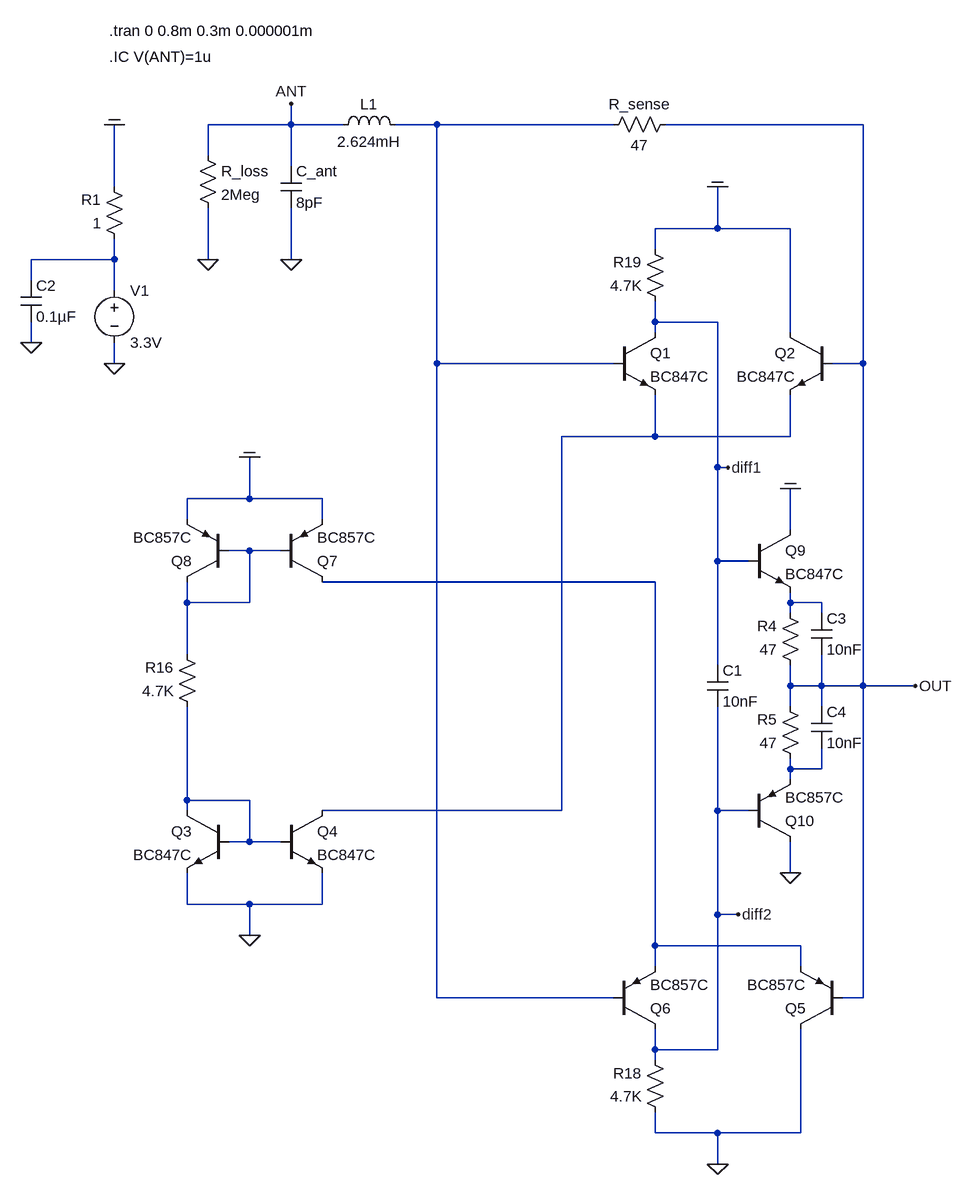
[diagram p0: schematic 2020_current_sense_comparator_npn_pnp_v02.asc]
2020_current_sense_comparator_npn_pnp_v02.asc, the LTspice schematic file:
Version 4
SHEET 1 3920 3748
WIRE -528 480 -528 448
WIRE -528 480 -656 480
WIRE -448 480 -528 480
WIRE -304 480 -368 480
WIRE -32 480 -304 480
WIRE 352 480 48 480
WIRE -656 528 -656 480
WIRE -528 544 -528 480
WIRE -800 576 -800 480
WIRE 128 640 128 576
WIRE 128 640 32 640
WIRE 240 640 128 640
WIRE 32 672 32 640
WIRE -800 688 -800 656
WIRE -800 688 -928 688
WIRE -656 688 -656 608
WIRE -528 688 -528 608
WIRE -928 720 -928 688
WIRE -800 736 -800 688
WIRE 32 784 32 752
WIRE 128 784 32 784
WIRE 32 800 32 784
WIRE 240 800 240 640
WIRE -928 816 -928 784
WIRE -800 848 -800 816
WIRE -304 848 -304 480
WIRE -32 848 -304 848
WIRE 352 848 352 480
WIRE 352 848 304 848
WIRE 32 960 32 896
WIRE 32 960 -112 960
WIRE 240 960 240 896
WIRE 240 960 32 960
WIRE 128 1008 128 784
WIRE 144 1008 128 1008
WIRE -592 1056 -592 992
WIRE -592 1056 -688 1056
WIRE -480 1056 -592 1056
WIRE -688 1088 -688 1056
WIRE -480 1088 -480 1056
WIRE 240 1104 240 1040
WIRE -592 1136 -624 1136
WIRE -544 1136 -592 1136
WIRE 128 1152 128 1008
WIRE 176 1152 128 1152
WIRE 32 1184 -480 1184
WIRE -688 1216 -688 1184
WIRE -592 1216 -592 1136
WIRE -592 1216 -688 1216
WIRE 240 1216 240 1200
WIRE 288 1216 240 1216
WIRE 240 1232 240 1216
WIRE 288 1232 288 1216
WIRE -688 1296 -688 1216
WIRE 128 1312 128 1152
WIRE 240 1344 240 1312
WIRE 288 1344 288 1296
WIRE 288 1344 240 1344
WIRE 352 1344 352 848
WIRE 352 1344 288 1344
WIRE 432 1344 352 1344
WIRE 240 1376 240 1344
WIRE 288 1376 288 1344
WIRE 240 1472 240 1456
WIRE 288 1472 288 1440
WIRE 288 1472 240 1472
WIRE 240 1488 240 1472
WIRE -688 1520 -688 1376
WIRE -592 1520 -688 1520
WIRE -688 1536 -688 1520
WIRE -112 1536 -112 960
WIRE -112 1536 -480 1536
WIRE 128 1536 128 1376
WIRE 176 1536 128 1536
WIRE -592 1584 -592 1520
WIRE -592 1584 -624 1584
WIRE -544 1584 -592 1584
WIRE 240 1632 240 1584
WIRE -688 1680 -688 1632
WIRE -592 1680 -688 1680
WIRE -480 1680 -480 1632
WIRE -480 1680 -592 1680
WIRE 128 1696 128 1536
WIRE 160 1696 128 1696
WIRE -592 1728 -592 1680
WIRE 32 1744 32 1184
WIRE 256 1744 32 1744
WIRE 32 1776 32 1744
WIRE 256 1776 256 1744
WIRE -304 1824 -304 848
WIRE -32 1824 -304 1824
WIRE 352 1824 352 1344
WIRE 352 1824 320 1824
WIRE 32 1904 32 1872
WIRE 128 1904 128 1696
WIRE 128 1904 32 1904
WIRE 32 1920 32 1904
WIRE 32 2032 32 2000
WIRE 128 2032 32 2032
WIRE 256 2032 256 1872
WIRE 256 2032 128 2032
WIRE 128 2080 128 2032
FLAG -800 848 0
FLAG -800 480 COM
FLAG -528 688 0
FLAG -528 448 ANT
FLAG -656 688 0
FLAG -592 1728 0
FLAG 128 576 COM
FLAG -592 992 COM
FLAG 128 2080 0
FLAG 240 1040 COM
FLAG 240 1632 0
FLAG 432 1344 OUT
FLAG 144 1008 diff1
FLAG 160 1696 diff2
FLAG -928 816 0
SYMBOL voltage -800 720 R0
WINDOW 123 0 0 Left 0
WINDOW 39 0 0 Left 0
SYMATTR InstName V1
SYMATTR Value 3.3V
SYMBOL ind -464 496 R270
WINDOW 0 32 56 VTop 2
WINDOW 3 5 56 VBottom 2
SYMATTR InstName L1
SYMATTR Value 2.624mH
SYMATTR SpiceLine Rser=66 Rpar=10Meg Cpar=1.216pF
SYMBOL cap -544 544 R0
SYMATTR InstName C_ant
SYMATTR Value 8pF
SYMBOL res -672 512 R0
SYMATTR InstName R_loss
SYMATTR Value 2Meg
SYMBOL res 64 464 R90
WINDOW 0 0 56 VBottom 2
WINDOW 3 32 56 VTop 2
SYMATTR InstName R_sense
SYMATTR Value 47
SYMBOL npn -32 800 R0
SYMATTR InstName Q1
SYMATTR Value BC847C
SYMBOL npn 304 800 M0
SYMATTR InstName Q2
SYMATTR Value BC847C
SYMBOL npn -624 1536 M0
SYMATTR InstName Q3
SYMATTR Value BC847C
SYMBOL npn -544 1536 R0
SYMATTR InstName Q4
SYMATTR Value BC847C
SYMBOL pnp 320 1872 R180
SYMATTR InstName Q5
SYMATTR Value BC857C
SYMBOL pnp -32 1872 M180
SYMATTR InstName Q6
SYMATTR Value BC857C
SYMBOL pnp -544 1184 M180
SYMATTR InstName Q7
SYMATTR Value BC857C
SYMBOL pnp -624 1184 R180
SYMATTR InstName Q8
SYMATTR Value BC857C
SYMBOL res -672 1392 R180
WINDOW 0 36 76 Left 2
WINDOW 3 36 40 Left 2
SYMATTR InstName R16
SYMATTR Value 4.7K
SYMBOL res 48 2016 R180
WINDOW 0 36 76 Left 2
WINDOW 3 36 40 Left 2
SYMATTR InstName R18
SYMATTR Value 4.7K
SYMBOL res 48 768 R180
WINDOW 0 36 76 Left 2
WINDOW 3 36 40 Left 2
SYMATTR InstName R19
SYMATTR Value 4.7K
SYMBOL npn 176 1104 R0
SYMATTR InstName Q9
SYMATTR Value BC847C
SYMBOL pnp 176 1584 M180
SYMATTR InstName Q10
SYMATTR Value BC857C
SYMBOL cap 112 1312 R0
SYMATTR InstName C1
SYMATTR Value 10nF
SYMBOL res 256 1328 R180
WINDOW 0 36 76 Left 2
WINDOW 3 36 40 Left 2
SYMATTR InstName R4
SYMATTR Value 47
SYMBOL res 256 1472 R180
WINDOW 0 36 76 Left 2
WINDOW 3 36 40 Left 2
SYMATTR InstName R5
SYMATTR Value 47
SYMBOL res -784 672 R180
WINDOW 0 36 76 Left 2
WINDOW 3 36 40 Left 2
SYMATTR InstName R1
SYMATTR Value 1
SYMBOL cap -944 720 R0
SYMATTR InstName C2
SYMATTR Value 0.1µF
SYMBOL cap 272 1232 R0
SYMATTR InstName C3
SYMATTR Value 10nF
SYMBOL cap 272 1376 R0
SYMATTR InstName C4
SYMATTR Value 10nF
TEXT -808 336 Left 2 !.tran 0 0.8m 0.3m 0.000001m
TEXT -808 376 Left 2 !.IC V(ANT)=1u

The netlist it stands for:
* 2020_current_sense_comparator_npn_pnp_v02.asc
V1 N002 0 3.3V
L1 ANT N001 2.624mH Rser=66 Rpar=10Meg Cpar=1.216pF
C_ant ANT 0 8pF
R_loss ANT 0 2Meg
R_sense OUT N001 47
Q1 diff1 N001 N003 0 BC847C
Q2 COM OUT N003 0 BC847C
Q3 N008 N008 0 0 BC847C
Q4 N003 N008 0 0 BC847C
Q5 0 OUT N005 0 BC857C
Q6 diff2 N001 N005 0 BC857C
Q7 N005 N004 COM 0 BC857C
Q8 N004 N004 COM 0 BC857C
R16 N008 N004 4.7K
R18 0 diff2 4.7K
R19 diff1 COM 4.7K
Q9 COM diff1 N006 0 BC847C
Q10 0 diff2 N007 0 BC857C
C1 diff1 diff2 10nF
R4 OUT N006 47
R5 N007 OUT 47
R1 N002 COM 1
C2 N002 0 0.1µF
C3 N006 OUT 10nF
C4 OUT N007 10nF
.model NPN NPN
.model PNP PNP
.lib standard.bjt
.tran 0 0.8m 0.3m 0.000001m
.IC V(ANT)=1u
.backanno
.end